# EAGLE schematic Schematic_final (EAGLE 9.6.2)
AUTHOR: FREEMAN, IKNOIAN, HOYE; BOARD_NAME: DRAFT 1; DOC_NUM: 1; PROJECT_NAME: ME 507 DRAFT 1; REVISION: 1; TITLE: SCHEMATIC DRAFT
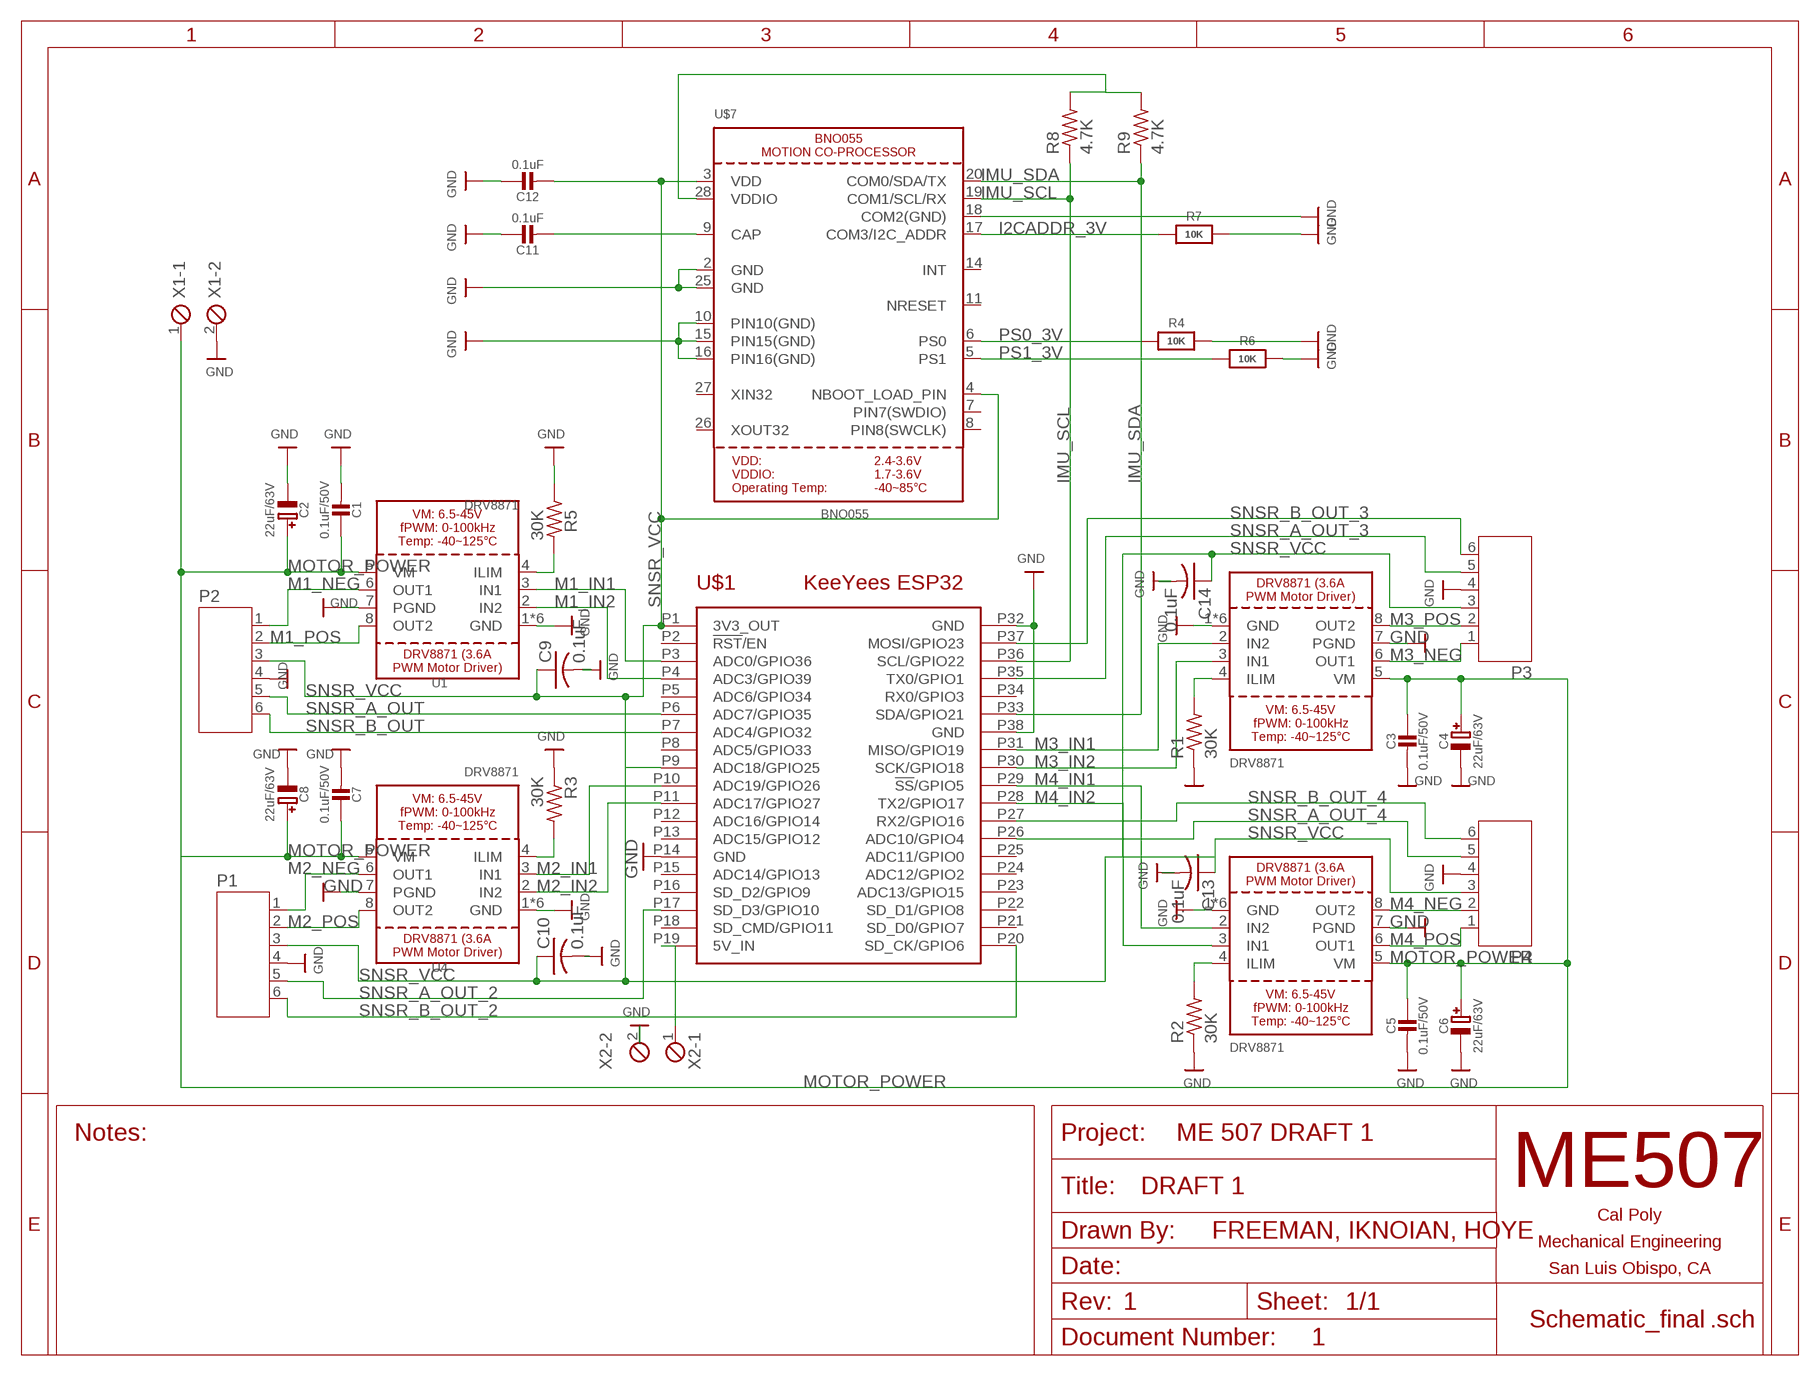
[diagram p0: schematic, sheet 1]

## Parts
C1  0.1uF/50V  CAP_CERAMIC0805-NOOUTLINE  [0805-NO]
C2  22uF/63V  CAP_ELECTROLYTICPANASONIC_D  [PANASONIC_D]
C3  0.1uF/50V  CAP_CERAMIC0805-NOOUTLINE  [0805-NO]
C4  22uF/63V  CAP_ELECTROLYTICPANASONIC_D  [PANASONIC_D]
C5  0.1uF/50V  CAP_CERAMIC0805-NOOUTLINE  [0805-NO]
C6  22uF/63V  CAP_ELECTROLYTICPANASONIC_D  [PANASONIC_D]
C7  0.1uF/50V  CAP_CERAMIC0805-NOOUTLINE  [0805-NO]
C8  22uF/63V  CAP_ELECTROLYTICPANASONIC_D  [PANASONIC_D]
C9  0.1uF  C-US025-030X050  [C025-030X050]
C10  0.1uF  C-US025-030X050  [C025-030X050]
C11  0.1uF  CAP_CERAMIC0805-NOOUTLINE  [0805-NO]
C12  0.1uF  CAP_CERAMIC0805_10MGAP  [0805_10MGAP]
C13  0.1uF  C-US025-030X050  [C025-030X050]
C14  0.1uF  C-US025-030X050  [C025-030X050]
P1  JST-PH6  [JST-PH6]
P2  JST-PH6  [JST-PH6]
P3  JST-PH6  [JST-PH6]
P4  JST-PH6  [JST-PH6]
R1  30K  FLIPFLOP-RES  [0805-THM]
R2  30K  FLIPFLOP-RES  [0805-THM]
R3  30K  FLIPFLOP-RES  [0805-THM]
R4  10K  RESISTOR0805_NOOUTLINE  [0805-NO]
R5  30K  FLIPFLOP-RES  [0805-THM]
R6  10K  RESISTOR0805_NOOUTLINE  [0805-NO]
R7  10K  RESISTOR0805_NOOUTLINE  [0805-NO]
R8  4.7K  R-US_R0805  [R0805]
R9  4.7K  R-US_R0805  [R0805]
U1  DRV8871  [HSOP8]
U2  DRV8871  [HSOP8]
U3  DRV8871  [HSOP8]
U4  DRV8871  [HSOP8]
U$1  KEEYEES_ESP32  [KEEYEES_ESP32]
U$7  BNO055  [BNO055]
X1  SCREWTERM_2P_254  [2POL254]
X2  SCREWTERM_2P_254  [2POL254]

## Nets
ESP_PWR: U$1.P19(5V_IN) X2.1
GND: C1.2 C2.- C3.2 C4.- C5.2 C6.- C7.2 C8.- C9.2 C10.2 C11.1 C12.1 C13.2 C14.2 P1.4 P2.4 P3.4 P4.4 R1.1 R2.1 R3.1 R4.2 R5.1 R6.2 R7.2 U1.1(GND) U1.7(PGND) U1.GND U1.P$1(GND) U1.P$2(GND) U1.P$3(GND) U1.P$4(GND) U2.1(GND) U2.7(PGND) U2.GND U2.P$1(GND) U2.P$2(GND) U2.P$3(GND) U2.P$4(GND) U3.1(GND) U3.7(PGND) U3.GND U3.P$1(GND) U3.P$2(GND) U3.P$3(GND) U3.P$4(GND) U4.1(GND) U4.7(PGND) U4.GND U4.P$1(GND) U4.P$2(GND) U4.P$3(GND) U4.P$4(GND) U$1.P14(GND) U$1.P32(GND) U$1.P38(GND) U$7.2(GND) U$7.10(PIN10(GND)) U$7.15(PIN15(GND)) U$7.16(PIN16(GND)) U$7.18(COM2(GND)) U$7.25(GND) X1.2 X2.2
I2CADDR_3V: R7.1 U$7.17(COM3/I2C_ADDR)
IMU_SCL: R8.1 U$1.P36(SCL/GPIO22) U$7.19(COM1/SCL/RX)
IMU_SDA: R9.1 U$1.P33(SDA/GPIO21) U$7.20(COM0/SDA/TX)
M1_IN1: U1.3(IN1) U$1.P3(ADC0/GPIO36)
M1_IN2: U1.2(IN2) U$1.P4(ADC3/GPIO39)
M1_NEG: P2.1 U1.6(OUT1)
M1_POS: P2.2 U1.8(OUT2)
M2_IN1: U4.3(IN1) U$1.P10(ADC19/GPIO26)
M2_IN2: U4.2(IN2) U$1.P11(ADC17/GPIO27)
M2_NEG: P1.1 U4.6(OUT1)
M2_POS: P1.2 U4.8(OUT2)
M3_IN1: U2.2(IN2) U$1.P31(MISO/GPIO19)
M3_IN2: U2.3(IN1) U$1.P30(SCK/GPIO18)
M3_NEG: P3.1 U2.6(OUT1)
M3_POS: P3.2 U2.8(OUT2)
M4_IN1: U3.2(IN2) U$1.P29(!SS!/GPIO5)
M4_IN2: U3.3(IN1) U$1.P28(TX2/GPIO17)
M4_NEG: P4.2 U3.8(OUT2)
M4_POS: P4.1 U3.6(OUT1)
MOTOR_POWER: C1.1 C2.+ C3.1 C4.+ C5.1 C6.+ C7.1 C8.+ U1.5(VM) U2.5(VM) U3.5(VM) U4.5(VM) X1.1
N$1: R1.2 U2.4(ILIM)
N$2: R2.2 U3.4(ILIM)
N$3: R3.2 U4.4(ILIM)
N$4: R8.2 R9.2 U$7.28(VDDIO)
N$5: U$1.P9(ADC18/GPIO25)
N$7: C11.2 U$7.9(CAP)
N$9: R5.2 U1.4(ILIM)
PS0_3V: R4.1 U$7.6(PS0)
PS1_3V: R6.1 U$7.5(PS1)
SNSR_A_OUT: P2.5 U$1.P6(ADC7/GPIO35)
SNSR_A_OUT_2: P1.5 U$1.P17(SD_D3/GPIO10)
SNSR_A_OUT_3: P3.5 U$1.P35(TX0/GPIO1)
SNSR_A_OUT_4: P4.5 U$1.P26(ADC10/GPIO4)
SNSR_B_OUT: P2.6 U$1.P7(ADC4/GPIO32)
SNSR_B_OUT_2: P1.6 U$1.P20(SD_CK/GPIO6)
SNSR_B_OUT_3: P3.6 U$1.P37(MOSI/GPIO23)
SNSR_B_OUT_4: P4.6 U$1.P27(RX2/GPIO16)
SNSR_VCC: C9.1 C10.1 C12.2 C13.1 C14.1 P1.3 P2.3 P3.3 P4.3 U$1.P1(3V3_OUT) U$7.3(VDD) U$7.4(NBOOT_LOAD_PIN)
Unconnected: U$1.P2(!RST!/EN) U$1.P5(ADC6/GPIO34) U$1.P8(ADC5/GPIO33) U$1.P12(ADC16/GPIO14) U$1.P13(ADC15/GPIO12) U$1.P15(ADC14/GPIO13) U$1.P16(SD_D2/GPIO9) U$1.P18(SD_CMD/GPIO11) U$1.P21(SD_D0/GPIO7) U$1.P22(SD_D1/GPIO8) U$1.P23(ADC13/GPIO15) U$1.P24(ADC12/GPIO2) U$1.P25(ADC11/GPIO0) U$1.P34(RX0/GPIO3) U$7.7(PIN7(SWDIO)) U$7.8(PIN8(SWCLK)) U$7.11(NRESET) U$7.14(INT) U$7.26(XOUT32) U$7.27(XIN32)

## Library data of the parts
C1 C3 C5 C7 C11 C12 = microbuilder:CAP_CERAMIC: Ceramic Capacitors For new designs, use the packages preceded by an '_' character since they are more reliable: The following footprints should be used on most boards: _0402 - Standard footprint for regular board layouts _0603 - Standard footprint for regular board layouts _0805 - Standard footprint for regular board layouts _1206 - Standard footprint for regular board layouts For extremely tight-pitch boards where space is at a premium, the following 'micro-pitch' footprints can be used (smaller pads, no silkscreen outline, etc.): _0402MP - Micro-pitch footprint for very dense/compact boards _0603MP - Micro-pitch footprint for very dense/compact boards _0805MP - Micro-pitch footprint for very dense/compact boards _1206MP - Micro-pitch footprint for very dense/compact boards
C2 C4 C6 C8 = microbuilder:CAP_ELECTROLYTIC: Electrolytic Capacitors SMT PANASONIC_C - Size C Panasonic Electrolytic Aluminum Capacitor 47µF 16V 20% Electrolytic Capacitor [Digikey: PCE3890TR-ND] PANASONIC_D - Size D Panasonic Electrolytic Aluminum Capacitor 100µF 25V 20% Electrolytic Capacitor [Digikey: PCE3898TR-ND] PTH 3.5 mm grid, 8 mm diameter ... 3.5 mm grid, 10 mm diameter ...
C9 C10 C13 C14 = adafruit:C-US: CAPACITOR, American symbol
P1-P4 = jst-ph:JST-PH6
R1-R3 R5 = adafruit:FLIPFLOP-RES: Flip Flop resistor An 0805 resistor inside a standard 1/4W 5% resistor. Makes for easy mods
R4 R6 R7 = microbuilder:RESISTOR: Resistors For new designs, use the packages preceded by an '_' character since they are more reliable: The following footprints should be used on most boards: _0402 - Standard footprint for regular board layouts _0603 - Standard footprint for regular board layouts _0805 - Standard footprint for regular board layouts _1206 - Standard footprint for regular board layouts For extremely tight-pitch boards where space is at a premium, the following 'micro-pitch' footprints can be used (smaller pads, no silkscreen outline, etc.): _0402MP - Micro-pitch footprint for very dense/compact boards _0603MP - Micro-pitch footprint for very dense/compact boards _0805MP - Micro-pitch footprint for very dense/compact boards _1206MP - Micro-pitch footprint for very dense/compact boards
R8 R9 = rcl:R-US_: RESISTOR, American symbol; SPICEPREFIX: R
U1-U4 = microbuilder:DRV8871: DRV8871 - 3.6A PWM Motor Driver
U$1 = ME507 (1):KEEYEES_ESP32: Footprint for an add-on board (shield, hat, etc.) for a KeeYees ESP32 development board with ESP-WROOM-32 module. 38 pins.
U$7 = microbuilder:BNO055: BNO055 - Motion Co-Processor
X1 X2 = ME507 (1):SCREWTERM_2P: Screw Terminal Block This part is designed for a screw terminal connector. The 2.54mm (0.100 inch) foorprint can also be used for male or female pin headers such as those on most development boards. One can also solder wires directly into the holes, though this makes modifications or repairs to the system more inconvenient. Larger versions can carry more current.